# Altium project CmosTest.PrjPCB
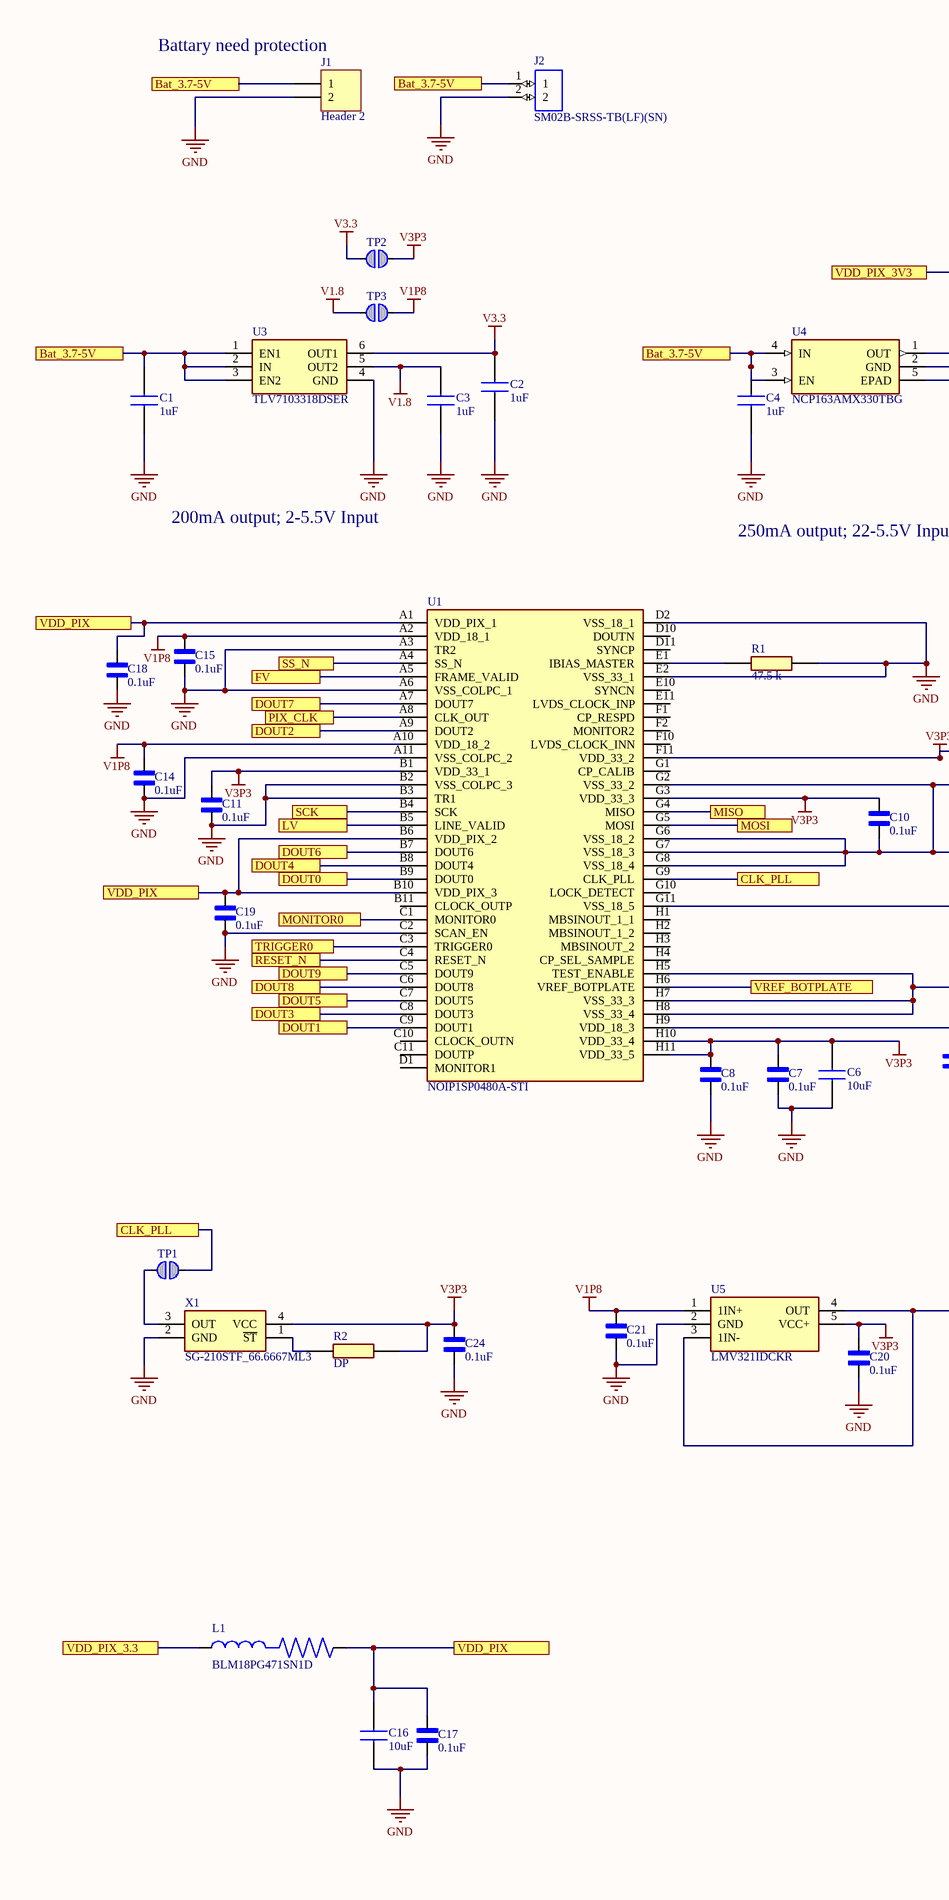
[diagram p0: CmosTest20231115V3.SchDoc, left]
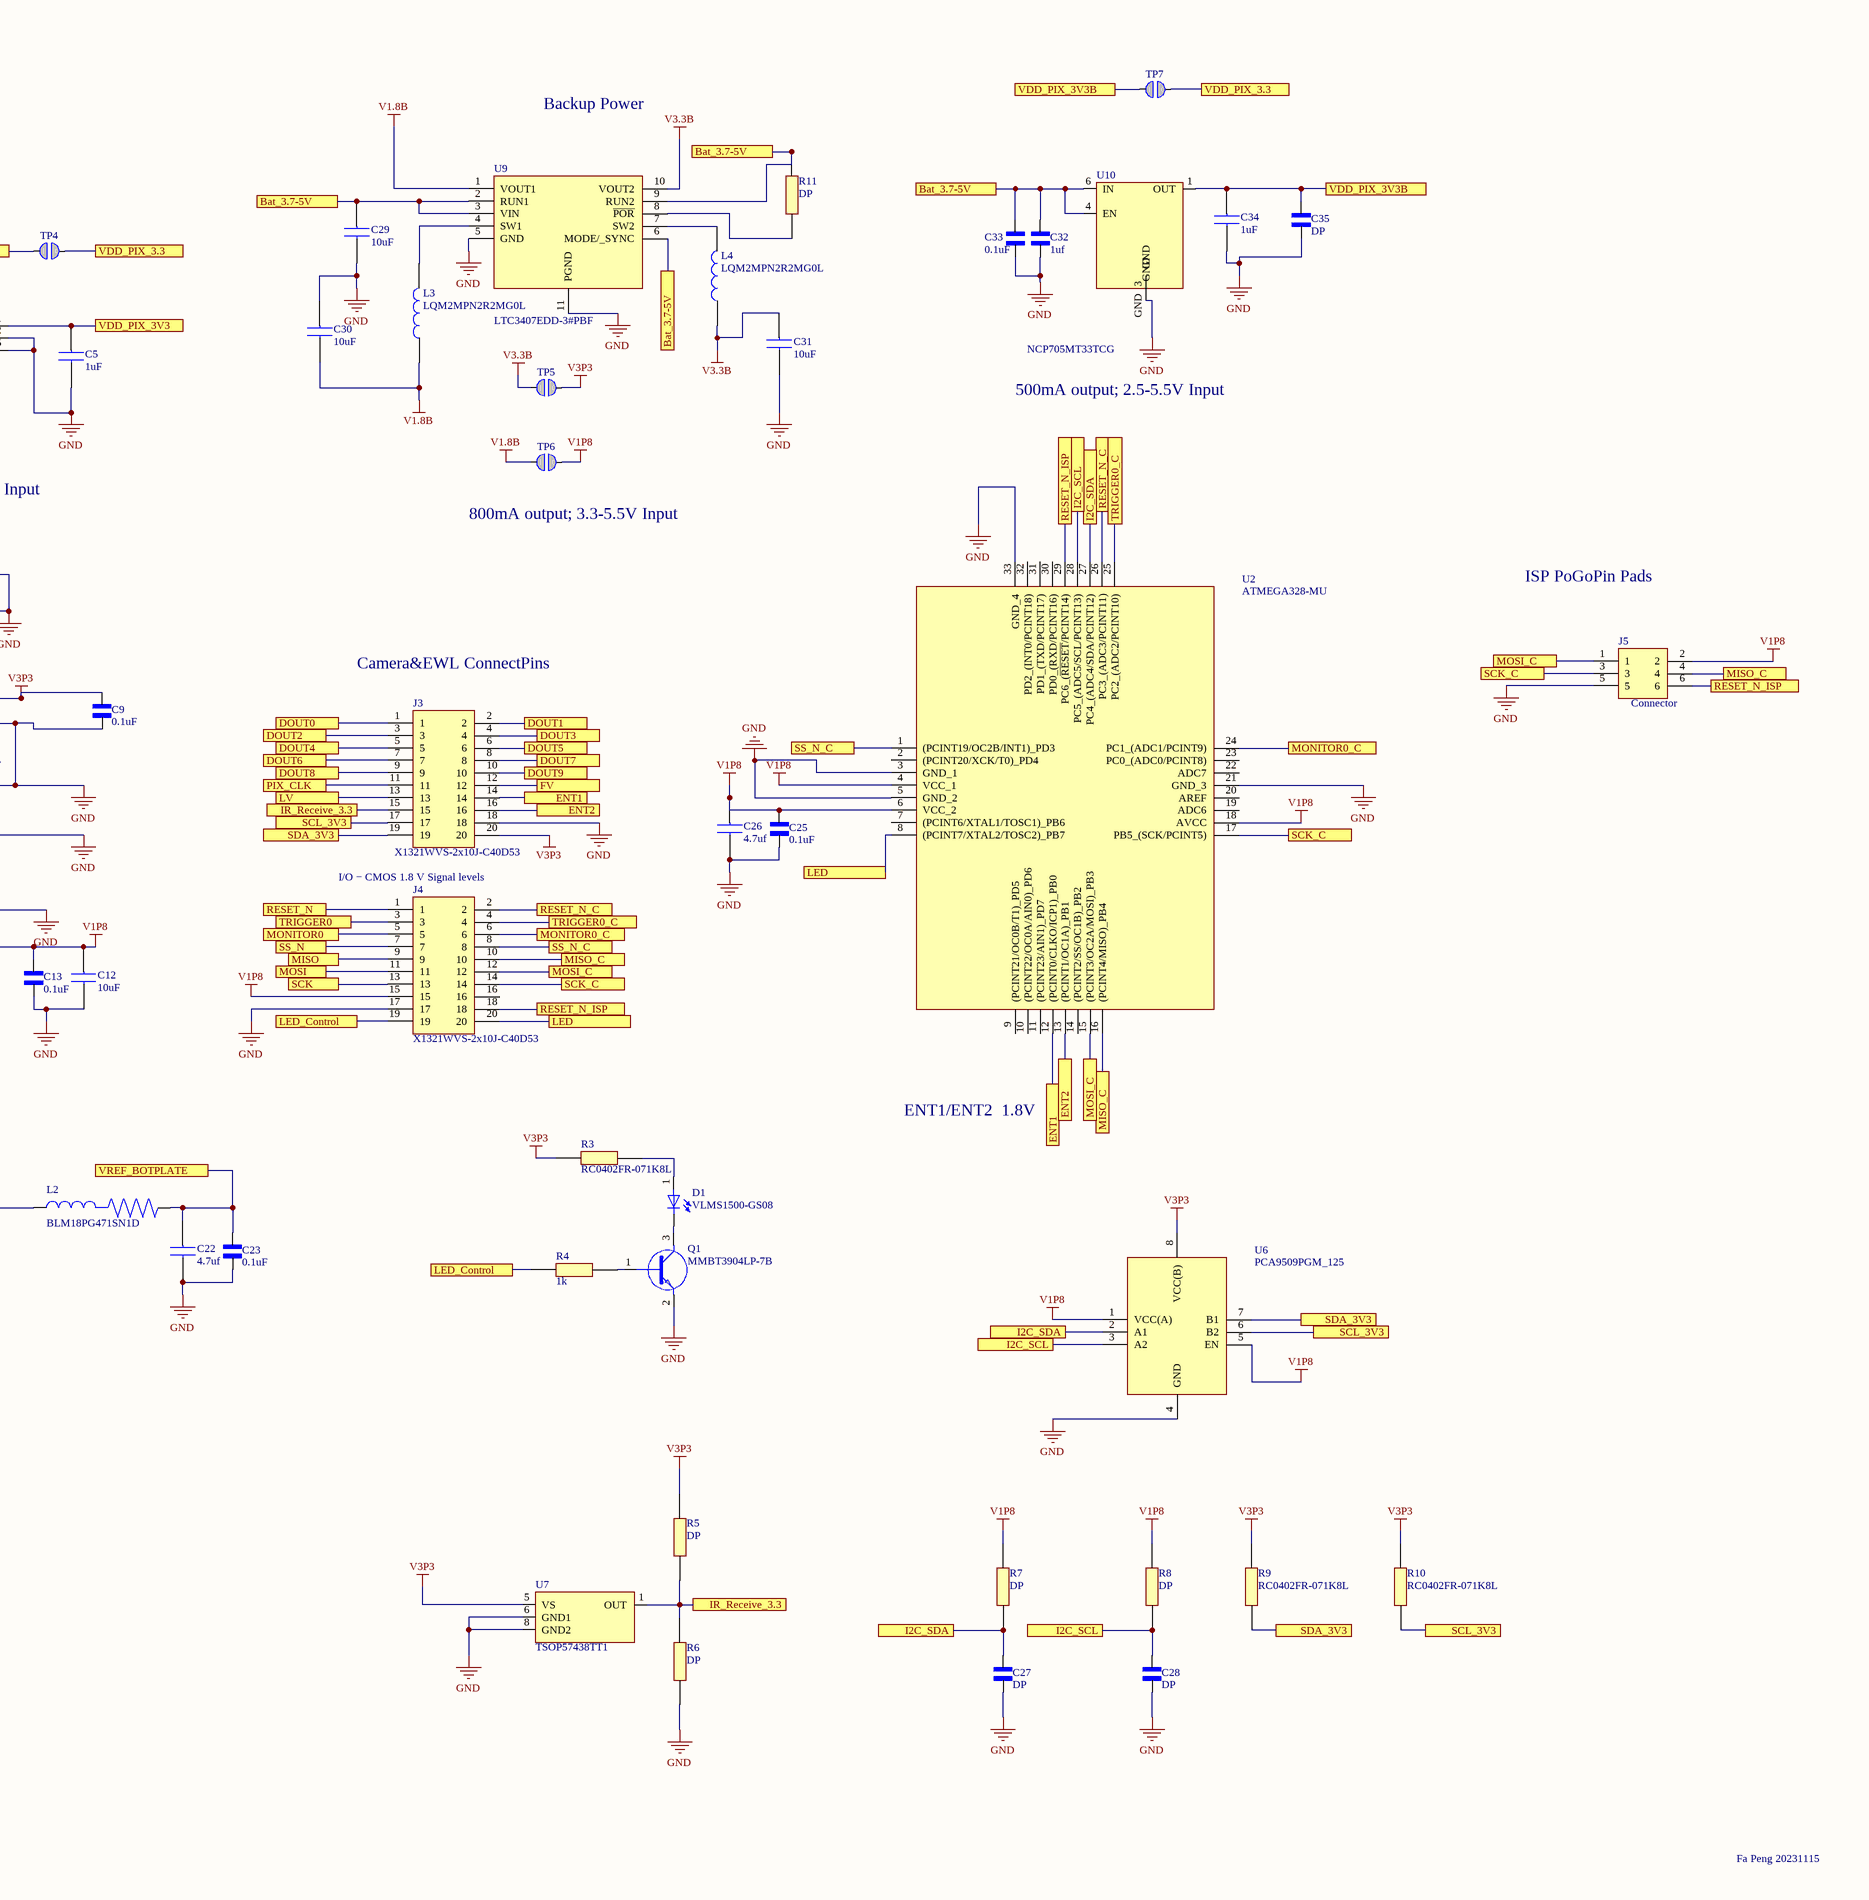
[diagram p1: CmosTest20231115V3.SchDoc, right]
1 sheet, 74 parts. Net scope: flat (ports and power ports of the same name join across sheets).
Board file: CmosTest20231115V2.PcbDoc

## Sheet CmosTest20231115V3.SchDoc
size A2

### Parts
C1  1uF  [CAPC1005X55N]
C2  1uF  [CAPC1005X55N]
C3  1uF  [CAPC1005X55N]
C4  1uF  [CAPC1005X55N]
C5  1uF  [CAPC1005X55N]
C6  10uF  [CAPC1005X56N]
C7  0.1uF  [CAPC1005X55N]
C8  0.1uF  [CAPC1005X55N]
C9  0.1uF  [CAPC1005X55N]
C10  0.1uF  [CAPC1005X55N]
C11  0.1uF  [CAPC1005X55N]
C12  10uF  [CAPC1005X56N]
C13  0.1uF  [CAPC1005X55N]
C14  0.1uF  [CAPC1005X55N]
C15  0.1uF  [CAPC1005X55N]
C16  10uF  [CAPC1005X56N]
C17  0.1uF  [CAPC1005X55N]
C18  0.1uF  [CAPC1005X55N]
C19  0.1uF  [CAPC1005X55N]
C20  0.1uF  [CAPC1005X55N]
C21  0.1uF  [CAPC1005X55N]
C22  4.7uf  [CAPC1005X56N]
C23  0.1uF  [CAPC1005X55N]
C24  0.1uF  [CAPC1005X55N]
C25  0.1uF  [CAPC1005X55N]
C26  4.7uf  [CAPC1005X56N]
C27  DP  [CAPC1005X55N]
C28  DP  [CAPC1005X55N]
C29  10uF  [CAPC1005X56N]
C30  10uF  [CAPC1005X56N]
C31  10uF  [CAPC1005X56N]
C32  1uf  [CAPC1005X55N]
C33  0.1uF  [CAPC1005X55N]
C34  1uF  [CAPC1005X55N]
C35  DP  [CAPC1005X55N]
D1  VLMS1500-GS08  [RESC1005X40N]
J1  Header 2  [Head2_pad]
J2  SM02B-SRSS-TB(LF)(SN)  [SM02B-SRSS-TB(LF)(SN)]
J3  X1321WVS-2x10J-C40D53  [62332021021]
J4  X1321WVS-2x10J-C40D53  [62332021021]
J5  Component_1  (value not drawn)
L1  BLM18PG471SN1D  [BEADC1608X95N]
L2  BLM18PG471SN1D  [BEADC1608X95N]
L3  LQM2MPN2R2MG0L  [LQM2MPN1R0NG0L]
L4  LQM2MPN2R2MG0L  [LQM2MPN1R0NG0L]
Q1  MMBT3904LP-7B  [MMBT3904LP7B]
R1  47.5 k  [RESC1005X40N]
R2  DP  [RESC1005X40N]
R3  RC0402FR-071K8L  [RESC1005X40N]
R4  1k  [RESC1005X40N]
R5  DP  [RESC1005X40N]
R6  DP  [RESC1005X40N]
R7  DP  [RESC1005X40N]
R8  DP  [RESC1005X40N]
R9  RC0402FR-071K8L  [RESC1005X40N]
R10  RC0402FR-071K8L  [RESC1005X40N]
R11  DP  [RESC1005X40N]
TP1  Solderbridge  [Solderbridge]  (value not drawn)  (no BOM)
TP2  Solderbridge  [Solderbridge]  (value not drawn)  (no BOM)
TP3  Solderbridge  [Solderbridge]  (value not drawn)  (no BOM)
TP4  Solderbridge  [Solderbridge]  (value not drawn)  (no BOM)
TP5  Solderbridge  [Solderbridge]  (value not drawn)  (no BOM)
TP6  Solderbridge  [Solderbridge]  (value not drawn)  (no BOM)
TP7  Solderbridge  [Solderbridge]  (value not drawn)  (no BOM)
U1  NOIP1SP0480A-STI  [NOIP1SP0480ASTI]
U2  ATMEGA328-MU  [QFN50P500X500X100-33N-D]
U3  TLV7103318DSER  [SON50P150X150X80-6N]
U4  NCP163AMX330TBG  [REG_NCP114AMX330TBG]
U5  LMV321IDCKR  [SOT65P210X110-5N]
U6  PCA9509PGM_125  [PCA9509PGM125]
U7  TSOP57438TT1  [TSOP572]
U9  LTC3407EDD-3#PBF  [SON50P300X300X80-11N-D]
U10  NCP705MT33TCG  [WDFN6]
X1  SG-210STF_66.6667ML3  [SG210STF625000ML3]

### Ports
Bat_3.7-5V, CLK_PLL, DOUT0, DOUT1, DOUT2, DOUT3, DOUT4, DOUT5, DOUT6, DOUT7, DOUT8, DOUT9, ENT1, ENT2, FV, I2C_SCL, I2C_SDA, IR_Receive_3.3, LED, LED_Control, LV, MISO, MISO_C, MONITOR0, MONITOR0_C, MOSI, MOSI_C, PIX_CLK, RESET_N, RESET_N_C, RESET_N_ISP, SCK, SCK_C, SCL_3V3, SDA_3V3, SS_N, SS_N_C, TRIGGER0, TRIGGER0_C, VDD_PIX, VDD_PIX_3.3, VDD_PIX_3V3, VDD_PIX_3V3B, VREF_BOTPLATE

### Nets
GND: C1.1 C2.1 C3.1 C4.1 C5.1 C6.1 C7.2 C8.2 C9.2 C10.2 C11.2 C12.1 C13.2 C14.2 C15.2 C16.1 C17.2 C18.2 C19.2 C20.2 C21.2 C22.1 C23.2 C24.2 C25.2 C26.1 C27.2 C28.2 C29.1 C30.2 C31.1 C32.1 C33.2 C34.1 C35.2 J1.2 J2.2 J3.18 J4.17 J5.5 Q1.2(E) R1.2 R6.2 U1.A3(TR2) U1.A6(VSS_COLPC_1) U1.A11(VSS_COLPC_2) U1.B2(VSS_COLPC_3) U1.B3(TR1) U1.C2(SCAN_EN) U1.D2(VSS_18_1) U1.E2(VSS_33_1) U1.G2(VSS_33_2) U1.G6(VSS_18_2) U1.G7(VSS_18_3) U1.G8(VSS_18_4) U1.G11(VSS_18_5) U1.H5(TEST_ENABLE) U1.H7(VSS_33_3) U1.H8(VSS_33_4) U2.3(GND_1) U2.5(GND_2) U2.21(GND_3) U2.33(GND_4) U3.4(GND) U4.2(GND) U4.5(EPAD) U5.2(GND) U6.4(GND) U7.6(GND1) U7.8(GND2) U9.5(GND) U9.11(PGND) U10.GND X1.2(GND)
V1.8: C3.2 TP3.2 U3.5(OUT2)
V1.8B: C30.1 L3.1 TP6.2 U9.1(VOUT1)
V1P8: C12.2 C13.1 C14.1 C15.1 C21.1 C25.1 C26.2 J4.15 J5.2 R7.1 R8.1 TP3.1 TP6.1 U1.A2(VDD_18_1) U1.A10(VDD_18_2) U1.H9(VDD_18_3) U2.4(VCC_1) U2.6(VCC_2) U2.18(AVCC) U5.1(1IN+) U6.1(VCC(A)) U6.5(EN)
V3.3: C2.2 TP2.2 U3.6(OUT1)
V3.3B: C31.2 L4.1 TP5.2 U9.10(VOUT2)
V3P3: C6.2 C7.1 C8.1 C9.1 C10.1 C11.1 C20.1 C24.1 J3.20 R2.1 R3.1 R5.1 R9.2 R10.2 TP2.1 TP5.1 U1.B1(VDD_33_1) U1.F11(VDD_33_2) U1.G3(VDD_33_3) U1.H10(VDD_33_4) U1.H11(VDD_33_5) U5.5(VCC+) U6.8(VCC(B)) U7.5(VS) X1.4(VCC)
NetC1_2: C1.2 C4.2 C29.2 C32.2 C33.1 J1.1 J2.1 R11.2 U3.1(EN1) U3.2(IN) U3.3(EN2) U4.3(EN) U4.4(IN) U9.2(RUN1) U9.3(VIN) U9.6(MODE/_SYNC) U9.9(RUN2) U10.4(EN) U10.6(IN) ; port Bat_3.7-5V
NetC5_2: C5.2 TP4.2 U4.1(OUT) ; port VDD_PIX_3V3
NetC16_2: C16.2 C17.1 C18.1 C19.1 L1.2 U1.A1(VDD_PIX_1) U1.B6(VDD_PIX_2) U1.B10(VDD_PIX_3) ; port VDD_PIX
NetC22_2: C22.2 C23.1 L2.2 U1.H6(VREF_BOTPLATE) ; port VREF_BOTPLATE
NetC27_1: C27.1 R7.2 U2.27(PC4_(ADC4/SDA/PCINT12)) U6.2(A1) ; port I2C_SDA
NetC28_1: C28.1 R8.2 U2.28(PC5_(ADC5/SCL/PCINT13)) U6.3(A2) ; port I2C_SCL
NetC34_2: C34.2 C35.1 TP7.2 U10.1(OUT) ; port VDD_PIX_3V3B
NetD1_1: D1.1 R3.2
NetD1_2: D1.2 Q1.3(C)
NetJ3_1: J3.1 U1.B9(DOUT0) ; port DOUT0
NetJ3_2: J3.2 U1.C9(DOUT1) ; port DOUT1
NetJ3_3: J3.3 U1.A9(DOUT2) ; port DOUT2
NetJ3_4: J3.4 U1.C8(DOUT3) ; port DOUT3
NetJ3_5: J3.5 U1.B8(DOUT4) ; port DOUT4
NetJ3_6: J3.6 U1.C7(DOUT5) ; port DOUT5
NetJ3_7: J3.7 U1.B7(DOUT6) ; port DOUT6
NetJ3_8: J3.8 U1.A7(DOUT7) ; port DOUT7
NetJ3_9: J3.9 U1.C6(DOUT8) ; port DOUT8
NetJ3_10: J3.10 U1.C5(DOUT9) ; port DOUT9
NetJ3_11: J3.11 U1.A8(CLK_OUT) ; port PIX_CLK
NetJ3_12: J3.12 U1.A5(FRAME_VALID) ; port FV
NetJ3_13: J3.13 U1.B5(LINE_VALID) ; port LV
NetJ3_14: J3.14 U2.12((PCINT0/CLKO/ICP1)_PB0) ; port ENT1
NetJ3_15: J3.15 R5.2 R6.1 U7.1(OUT) ; port IR_Receive_3.3
NetJ3_16: J3.16 U2.13((PCINT1/OC1A)_PB1) ; port ENT2
NetJ3_17: J3.17 R10.1 U6.6(B2) ; port SCL_3V3
NetJ3_19: J3.19 R9.1 U6.7(B1) ; port SDA_3V3
NetJ4_1: J4.1 U1.C4(RESET_N) ; port RESET_N
NetJ4_2: J4.2 U2.26(PC3_(ADC3/PCINT11)) ; port RESET_N_C
NetJ4_3: J4.3 U1.C3(TRIGGER0) ; port TRIGGER0
NetJ4_4: J4.4 U2.25(PC2_(ADC2/PCINT10)) ; port TRIGGER0_C
NetJ4_5: J4.5 U1.C1(MONITOR0) ; port MONITOR0
NetJ4_6: J4.6 U2.24(PC1_(ADC1/PCINT9)) ; port MONITOR0_C
NetJ4_7: J4.7 U1.A4(SS_N) ; port SS_N
NetJ4_8: J4.8 U2.1((PCINT19/OC2B/INT1)_PD3) ; port SS_N_C
NetJ4_9: J4.9 U1.G4(MISO) ; port MISO
NetJ4_10: J4.10 J5.4 U2.16((PCINT4/MISO)_PB4) ; port MISO_C
NetJ4_11: J4.11 U1.G5(MOSI) ; port MOSI
NetJ4_12: J4.12 J5.1 U2.15((PCINT3/OC2A/MOSI)_PB3) ; port MOSI_C
NetJ4_13: J4.13 U1.B4(SCK) ; port SCK
NetJ4_14: J4.14 J5.3 U2.17(PB5_(SCK/PCINT5)) ; port SCK_C
NetJ4_18: J4.18 J5.6 U2.29(PC6_(~{RESET}/PCINT14)) ; port RESET_N_ISP
NetJ4_19: J4.19 R4.1 ; port LED_Control
NetJ4_20: J4.20 U2.8((PCINT7/XTAL2/TOSC2)_PB7) ; port LED
NetL1_1: L1.1 TP4.1 TP7.1 ; port VDD_PIX_3.3
NetL2_1: L2.1 U5.3(1IN-) U5.4(OUT)
NetL3_2: L3.2 U9.4(SW1)
NetL4_2: L4.2 U9.7(SW2)
NetQ1_1: Q1.1(B) R4.2
NetR1_1: R1.1 U1.E1(IBIAS_MASTER)
NetR2_2: R2.2 X1.1(~{ST})
NetR11_1: R11.1 U9.8(~{POR})
NetTP1_1: TP1.1 X1.3(OUT)
NetTP1_2: TP1.2 U1.G9(CLK_PLL) ; port CLK_PLL

Not connected (* = marked no-connect by the designer): J4 16; U1 B11(CLOCK_OUTP) C10(CLOCK_OUTN) C11(DOUTP) D1(MONITOR1) D10(DOUTN) D11(SYNCP) E10(SYNCN) E11(LVDS_CLOCK_INP) F1(CP_RESPD) F2(MONITOR2) F10(LVDS_CLOCK_INN) G1(CP_CALIB) G10(LOCK_DETECT) H1(MBSINOUT_1_1) H2(MBSINOUT_1_2) H3(MBSINOUT_2) H4(CP_SEL_SAMPLE); U2 2((PCINT20/XCK/T0)_PD4) 7((PCINT6/XTAL1/TOSC1)_PB6) 9((PCINT21/OC0B/T1)_PD5) 10((PCINT22/OC0A/AIN0)_PD6) 11((PCINT23/AIN1)_PD7) 14((PCINT2/SS/OC1B)_PB2) 19(ADC6) 20(AREF) 22(ADC7) 23(PC0_(ADC0/PCINT8)) 30(PD0_(RXD/PCINT16)) 31(PD1_(TXD/PCINT17)) 32(PD2_(INT0/PCINT18)); U10 3(GND)

### Notes on the sheet
- (near J1) Battary need protection
- Backup Power
- 500mA output; 2.5-5.5V Input
- 200mA output; 2-5.5V Input
- 250mA output; 22-5.5V Input
- (near TP6) 800mA output; 3.3-5.5V Input
- ISP PoGoPin Pads
- Camera&EWL ConnectPins
- I/O − CMOS 1.8 V Signal levels
- ENT1/ENT2  1.8V
- Fa Peng 20231115
- (in symbol Component_1) Connector

### Library data of the parts
C1 C4 C5 C34 = CC0402KRX5R6BB105: General purpose & High capacitance Class 2, X5R; Manufacturer_Name: KEMET; Geometry.Height: 0.55mm; Manufacturer_Part_Number: CC0402KRX5R6BB105; Mouser Part Number: 603-CC402KRX5R6BB105; Mouser Price/Stock: https://www.mouser.co.uk/ProductDetail/YAGEO/CC0402KRX5R6BB105?qs=BKNoF%2F0xMNu0TvpE6ze2Iw%3D%3D; Arrow Part Number: *; Arrow Price/Stock: *; Datasheet Link: https://www.mouser.co.uk/datasheet/2/447/UPY-GPHC_X5R_4V-to-50V_25-1131599.pdf
C2 = CC0402KRX5R6BB105: CC0402KRX5R6BB105;General purpose & High capacitance Class 2, X5R; Manufacturer_Name: KEMET; Geometry.Height: 0.55mm; Manufacturer_Part_Number: CC0402KRX5R6BB105; Mouser Part Number: 603-CC402KRX5R6BB105; Mouser Price/Stock: https://www.mouser.co.uk/ProductDetail/YAGEO/CC0402KRX5R6BB105?qs=BKNoF%2F0xMNu0TvpE6ze2Iw%3D%3D; Arrow Part Number: *; Arrow Price/Stock: *; Datasheet Link: https://www.mouser.co.uk/datasheet/2/447/UPY-GPHC_X5R_4V-to-50V_25-1131599.pdf
C3 = CC0402KRX5R6BB105: CC0402KRX5R6BB105; General purpose & High capacitance Class 2, X5R; Manufacturer_Name: KEMET; Geometry.Height: 0.55mm; Manufacturer_Part_Number: CC0402KRX5R6BB105; Mouser Part Number: 603-CC402KRX5R6BB105; Mouser Price/Stock: https://www.mouser.co.uk/ProductDetail/YAGEO/CC0402KRX5R6BB105?qs=BKNoF%2F0xMNu0TvpE6ze2Iw%3D%3D; Arrow Part Number: *; Arrow Price/Stock: *; Datasheet Link: https://www.mouser.co.uk/datasheet/2/447/UPY-GPHC_X5R_4V-to-50V_25-1131599.pdf
C6 C12 C16 C29-C31 = 0402ZD106MAT2A: 0402ZD106MAT2A; Multilayer Ceramic Capacitors MLCC - SMD/SMT 10V 10uF X5R 0402 20% Tol; Manufacturer_Name: AVX; Geometry.Height: 0.56mm; Manufacturer_Part_Number: 0402ZD106MAT2A; Mouser Part Number: 581-0402ZD106MAT2A; Mouser Price/Stock: https://www.mouser.co.uk/ProductDetail/AVX/0402ZD106MAT2A?qs=sJ5gq5MLFXpDfmjiItAxIg%3D%3D; Arrow Part Number: 0402ZD106MAT2A; Arrow Price/Stock: https://www.arrow.com/en/products/0402zd106mat2a/avx; Datasheet Link: http://www.mouser.com/catalog/supplier/library/pdf/AVXSurfaceMountCeramic.pdf
C7-C11 C13-C15 C17-C21 C23-C25 C27 C28 = GRM155R71C104KA88D: SMD Capacitor X7R_EIA_ with Capacitance: 0.10uF Tol. 10%. Rated Voltage: 16Vdc;GRM155R71C104KA88D; MF: Murata; Package: 1005 Taiyo Yuden; Value: *; MP: GRM155R71C104KA88D; SnapEDA_Link: https://www.snapeda.com/parts/GRM155R71C104KA88D/Murata%20Electronics%20North%20America/view-part/4750/?ref=snap
C22 C26 = 0402ZD475KAT2A: 0402ZD475KAT2A; Multilayer Ceramic Capacitors MLCC - SMD/SMT 10V 4.7uF 0402 10% CX5R; Manufacturer_Name: AVX; Geometry.Height: 0.56mm; Manufacturer_Part_Number: 0402ZD475KAT2A; Mouser Part Number: 581-0402ZD475KAT2A; Mouser Price/Stock: https://www.mouser.co.uk/ProductDetail/AVX/0402ZD475KAT2A?qs=%252BdQmOuGyFcGZ9hW2HGkxhw%3D%3D; Arrow Part Number: 0402ZD475KAT2A; Arrow Price/Stock: https://www.arrow.com/en/products/0402zd475kat2a/avx; Datasheet Link: http://www.mouser.com/catalog/supplier/library/pdf/AVXSurfaceMountCeramic.pdf
C32 C33 C35 = GRM155R71C104KA88D: SMD Capacitor X7R_EIA_ with Capacitance: 0.10uF Tol. 10%. Rated Voltage: 16Vdc; MF: Murata; Package: 1005 Taiyo Yuden; Value: *; MP: GRM155R71C104KA88D; SnapEDA_Link: https://www.snapeda.com/parts/GRM155R71C104KA88D/Murata%20Electronics%20North%20America/view-part/4750/?ref=snap
D1 = VLMG1500-GS08: Super red 631nm LED Indication - Discrete 2V 0402 _1005 Metric_; MF: Vishay; Price: None; Availability: Unavailable; Package: 0402 Vishay; SnapEDA_Link: https://www.snapeda.com/parts/VLMG1500-GS08/Vishay%20Semiconductor%20Opto%20Division/view-part/450066/?ref=snap; MP: VLMG1500-GS08; Value: *
J1 = Header 2: Header, 2-Pin; LatestRevisionDate: 17-Jul-2002; LatestRevisionNote: Re-released for DXP Platform.; Publisher: Altium Limited
J2 = SM02B-SRSS-TB(LF)(SN): Connector Header Surface Mount, Right Angle 2 position 0.039 _1.00mm_; MP: SM02B-SRSS-TB_LF__SN_; MF: JST Sales; SnapEDA_Link: https://www.snapeda.com/parts/SM02B-SRSS-TB%28LF%29%28SN%29/JST%20Sales%20America%20Inc./view-part/447499/?ref=snap; Price: None; Value: *; Availability: Unavailable; Package: None
J3 J4 = 62332021021: X1321WVS-2x10J-C40D53; / Receptacle, Board-to-Board, 1.27 mm, 2 Rows, 20 Contacts, Surface Mount, WR-PHD Series; Manufacturer_Name: Wurth Elektronik; Geometry.Height: 4.7mm; Manufacturer_Part_Number: 62332021021; Mouser Part Number: 710-62332021021; Mouser Price/Stock: https://www.mouser.co.uk/ProductDetail/Wurth-Elektronik/62332021021?qs=7D1LtPJG0i3NvUz0HzEmOg%3D%3D; Arrow Part Number: *; Arrow Price/Stock: *; Datasheet Link: https://componentsearchengine.com/Datasheets/2/62332021021.pdf
L1 L2 = BLM18PG471SN1D: 470 Ohms @ 100MHz 1 Power Line Ferrite Bead 0603 _1608 Metric_ 1A 200mOhm; MF: Murata; Digi-Key_Purchase_URL: https://www.digikey.com.au/product-detail/en/murata-electronics/BLM18PG471SN1D/490-5223-1-ND/1948399?utm_source=snapeda&utm_medium=aggregator&utm_campaign=symbol; Value: *; Package: 1608 Murata; Digi-Key_Part_Number: 490-5223-1-ND; SnapEDA_Link: https://www.snapeda.com/parts/BLM18PG471SN1D/Murata/view-part/234090/?ref=snap; MP: BLM18PG471SN1D
L3 L4 = LQM2MPN2R2MG0L: LQM2MPN_G0 Series Inductor 2.2uH +/-20% 0806 (2016); Manufacturer_Name: Murata Electronics; Geometry.Height: 1mm; Manufacturer_Part_Number: LQM2MPN2R2MG0L; Mouser Part Number: 81-LQM2MPN2R2MG0L; Mouser Price/Stock: https://www.mouser.co.uk/ProductDetail/Murata-Electronics/LQM2MPN2R2MG0L?qs=YinlzBdtFMj9%2Fj5t8GanUg%3D%3D; Arrow Part Number: LQM2MPN2R2MG0L; Arrow Price/Stock: https://www.arrow.com/en/products/lqm2mpn2r2mg0l/murata-manufacturing?region=nac; Datasheet Link: https://psearch.en.murata.com/inductor/product/LQM2MPN2R2MG0%23.html
Q1 = MMBT3904LP-7B: Bipolar Transistors - BJT General Purpose Tran X1-DFN1006-3,10K 40V NPN SMALL SIGNAL TRANSISTOR IN X1-DFN1006-3; Manufacturer_Name: Diodes Inc.; Geometry.Height: 0.53mm; Manufacturer_Part_Number: MMBT3904LP-7B; Mouser Part Number: 621-MMBT3904LP-7B; Mouser Price/Stock: https://www.mouser.co.uk/ProductDetail/Diodes-Incorporated/MMBT3904LP-7B?qs=T%2FOtf55vL7cbkUjr%2FmBpPQ%3D%3D; Arrow Part Number: MMBT3904LP-7B; Arrow Price/Stock: https://www.arrow.com/en/products/mmbt3904lp-7b/diodes-incorporated?region=nac; Datasheet Link: https://www.diodes.com/assets/Datasheets/ds31835.pdf
R1 = ERJ-2RKF4752X: ERJ-2RKF4752X; Panasonic Surface Mount Fixed Resistor 47.5 k 0.1 W +/-100 ppm/C; Geometry.Height: 0.4mm; Manufacturer_Name: Panasonic; Manufacturer_Part_Number: ERJ-2RKF4752X; Mouser Part Number: 667-ERJ-2RKF4752X; Mouser Price/Stock: https://www.mouser.co.uk/ProductDetail/Panasonic/ERJ-2RKF4752X?qs=YMBIwoNQYdVljEm11tR4kg%3D%3D; Arrow Part Number: ERJ-2RKF4752X; Arrow Price/Stock: https://www.arrow.com/en/products/erj-2rkf4752x/panasonic; Datasheet Link: https://industrial.panasonic.com/cdbs/www-data/pdf/RDA0000/AOA0000C86.pdf
R2 R5-R8 R11 = RC0402FR-071K8L: Don't place; RESISTOR, 0402; Manufacturer_Name: KEMET; Geometry.Height: 0.4mm; Manufacturer_Part_Number: RC0402FR-071K8L; Mouser Part Number: 603-RC0402FR-071K8L; Mouser Price/Stock: https://www.mouser.co.uk/ProductDetail/Yageo/RC0402FR-071K8L/?qs=YUgVZYePFqBqgTt42z3XkQ%3D%3D; Arrow Part Number: RC0402FR-071K8L; Arrow Price/Stock: https://www.arrow.com/en/products/rc0402fr-071k8l/yageo; Datasheet Link: http://www.yageo.com/documents/recent/PYu-RC0402_51_RoHS_L_6_r.pdf
R3 R9 R10 = RC0402FR-071K8L: RESISTOR, 0402 1.8K Ohms +/-1% 1/16 W; Manufacturer_Name: KEMET; Geometry.Height: 0.4mm; Manufacturer_Part_Number: RC0402FR-071K8L; Mouser Part Number: 603-RC0402FR-071K8L; Mouser Price/Stock: https://www.mouser.co.uk/ProductDetail/Yageo/RC0402FR-071K8L/?qs=YUgVZYePFqBqgTt42z3XkQ%3D%3D; Arrow Part Number: RC0402FR-071K8L; Arrow Price/Stock: https://www.arrow.com/en/products/rc0402fr-071k8l/yageo; Datasheet Link: http://www.yageo.com/documents/recent/PYu-RC0402_51_RoHS_L_6_r.pdf
R4 = ERJ-2RKF4752X: AC0402FR-071KL;  0402 1KΩ ±1% 1/16W ±100ppm/℃; Manufacturer_Name: Panasonic; Geometry.Height: 0.4mm; Manufacturer_Part_Number: ERJ-2RKF4752X; Mouser Part Number: 667-ERJ-2RKF4752X; Mouser Price/Stock: https://www.mouser.co.uk/ProductDetail/Panasonic/ERJ-2RKF4752X?qs=YMBIwoNQYdVljEm11tR4kg%3D%3D; Arrow Part Number: ERJ-2RKF4752X; Arrow Price/Stock: https://www.arrow.com/en/products/erj-2rkf4752x/panasonic; Datasheet Link: https://industrial.panasonic.com/cdbs/www-data/pdf/RDA0000/AOA0000C86.pdf
TP1-TP7 = SOLDERBRIDGE: Manufacturer: N.A.; Pad Count: 2; Part Number: Solderbridge; Manufacturer Part Number: N.A.; LatestRevisionDate: 2009-12-14; Published: 2009-12-14; Value: Solderbridge; Note: N.A.; Artikkelnr Noca: N.A.; Footprint Doc: Solderbridge; Part number IPS: N.A.; ComponentLink1URL: N.A.; ComponentLink1Description: Datasheet; ComponentLink2URL: N.A.; ComponentLink2Description: Supplier link; HelpURL: N.A.; Supplier 1: N.A.; Supplier Part Number 1: N.A.; Supplier 2: N.A.; Supplier Part Number 2: N.A.; PartId: 100500458; Component Class: Connectors; Author: rsk; Part number Norautron: N.A.
U1 = NOIP1SP0480A-STI: Image Sensors PYTHON480 1/3.6 BW_ CRA; Manufacturer_Name: onsemi; Geometry.Height: 0.75mm; Manufacturer_Part_Number: NOIP1SP0480A-STI; Mouser Part Number: 863-NOIP1SP0480A-STI; Mouser Price/Stock: https://www.mouser.co.uk/ProductDetail/ON-Semiconductor/NOIP1SP0480A-STI?qs=MLItCLRbWsyoZFKf%252BDS9uw%3D%3D; Arrow Part Number: *; Arrow Price/Stock: *; Datasheet Link: https://www.onsemi.com/pdf/datasheet/noip1sn0480a-d.pdf
U2 = ATMEGA328-MU: MCU 8-bit ATmega AVR RISC 32KB Flash Atmel ATMEGA328-MU, 8bit AVR Microcontroller, 20MHz, 32 kB Flash, 32-Pin MLF; Manufacturer_Name: Microchip; Geometry.Height: 1mm; Manufacturer_Part_Number: ATMEGA328-MU; Mouser Part Number: 556-ATMEGA328-MU; Mouser Price/Stock: https://www.mouser.co.uk/ProductDetail/Microchip-Technology-Atmel/ATMEGA328-MU?qs=lwdSMh1%2FoYLgRc0I%252Bdg4Ag%3D%3D; Arrow Part Number: ATMEGA328-MU; Arrow Price/Stock: https://www.arrow.com/en/products/atmega328-mu/microchip-technology?region=europe; Datasheet Link: https://componentsearchengine.com/Datasheets/2/ATMEGA328-MU.pdf
U3 = TLV7103318DSER: Manufacturer_Name: Texas Instruments; Geometry.Height: 0.8mm; Manufacturer_Part_Number: TLV7103318DSER; Mouser Part Number: 595-TLV7103318DSER; Mouser Price/Stock: https://www.mouser.co.uk/ProductDetail/Texas-Instruments/TLV7103318DSER?qs=UlfnwZ2x8nSAnP31dntgZA%3D%3D; Arrow Part Number: TLV7103318DSER; Arrow Price/Stock: https://www.arrow.com/en/products/tlv7103318dser/texas-instruments?region=nac; Datasheet Link: https://pdf1.alldatasheet.com/datasheet-pdf/view/457316/TI1/TLV7103318DSER.html
U4 = NCP114AMX330TBG: NCP163(Vi 2.2-5..5V); Linear Voltage Regulator IC Positive Fixed 1 Output 250mA 4-UDFN _1.0x1.0_; MF: ON Semiconductor; MP: NCP114AMX330TBG; Availability: Unavailable; Package: UDFN-4 ON Semiconductor; Value: *; Price: None; SnapEDA_Link: https://www.snapeda.com/parts/NCP114AMX330TBG/ON%20Semiconductor/view-part/711351/?ref=snap
U5 = LMV321IDCKR: Single Low-Voltage Rail-to-Rail Output Operational Amplifier  see LMV321A for upgraded version; Manufacturer_Name: Texas Instruments; Geometry.Height: 1.1mm; Manufacturer_Part_Number: LMV321IDCKR; Mouser Part Number: 595-LMV321IDCKR; Mouser Price/Stock: https://www.mouser.co.uk/ProductDetail/Texas-Instruments/LMV321IDCKR?qs=p6YqzpSxLIzuatXd1sAikQ%3D%3D; Arrow Part Number: LMV321IDCKR; Arrow Price/Stock: https://www.arrow.com/en/products/lmv321idckr/texas-instruments?region=nac; Datasheet Link: http://www.ti.com/lit/ds/symlink/lmv324.pdf
U6 = PCA9509PGM_125: Interface - Signal Buffers, Repeaters I2C/SMBus IC REDRIVER I2C 2CH 400KHZ 8XQFN Repeater Buffer, ReDriver 2 Channel 400kHz 8-XQFN (1.6x1.6); Manufacturer_Name: NXP; Manufacturer_Part_Number: PCA9509PGM,125; Geometry.Height: 0.5mm; Mouser Part Number: 771-PCA9509PGM,125; Mouser Price/Stock: https://www.mouser.co.uk/ProductDetail/NXP-Semiconductors/PCA9509PGM125?qs=vnbNJPHmPnOjnFlZ8zO94w%3D%3D; Arrow Part Number: PCA9509PGM,125; Arrow Price/Stock: https://www.arrow.com/en/products/pca9509pgm125/nxp-semiconductors?region=nac; Datasheet Link: http://www.nxp.com/docs/en/data-sheet/PCA9509P.pdf
U7 = TSOP57238TT1: Remote Receiver Sensor, 38.0kHz 40m Surface Mount; MF: Vishay Semiconductor; SnapEDA_Link: https://www.snapeda.com/parts/TSOP57238TT1/Vishay%20Semiconductor%20Opto%20Division/view-part/395850/?ref=snap; Availability: Warning; MP: TSOP57238TT1; Purchase-URL: https://pricing.snapeda.com/search/part/TSOP57238TT1/?ref=eda; Check_prices: https://www.snapeda.com/parts/TSOP57238TT1/Vishay%20Semiconductor%20Opto%20Division/view-part/395850/?ref=eda; Price: None; Value: *; Package: None
U9 = LTC3407EDD-3#PBF: BUCK, SYNCH, DUAL, 0.8A, 2.25MHZ, 10MSOP; Manufacturer_Name: Analog Devices; Geometry.Height: 0.8mm; Manufacturer_Part_Number: LTC3407EDD-3#PBF; Mouser Part Number: 584-LTC3407EDD-3#PBF; Mouser Price/Stock: https://www.mouser.com/Search/Refine.aspx?Keyword=584-LTC3407EDD-3%23PBF; Arrow Part Number: LTC3407EDD-3#PBF; Arrow Price/Stock: https://www.arrow.com/en/products/ltc3407edd-3pbf/analog-devices; Datasheet Link: https://datasheet.datasheetarchive.com/originals/distributors/SFDatasheet-4/sf-00091830.pdf
U10 = NCP705: Ultra-Low Quiescent Current, Ultra-Low Noise, LDO Voltage Regulator<br> <br> Data sheet: <br> http://www.onsemi.com/pub_link/Collateral/NCP705-D.PDF<br>; Package: None; Price: None; Value: *; MP: NCP705; Availability: Unavailable
X1 = SG-210STF_62.5000ML3: Standard Clock Oscillators 66.6666MHz 50ppm -40C +85C; Manufacturer_Name: Epson Timing; Manufacturer_Part_Number: SG-210STF 62.5000ML3; Geometry.Height: 0.9mm; Mouser Part Number: 732-SG210STF62.500L3; Mouser Price/Stock: https://www.mouser.co.uk/ProductDetail/Epson-Timing/SG-210STF-62.5000ML3?qs=6J2kD0vu%2F2XqkCRh4YYW9A%3D%3D; Arrow Part Number: *; Arrow Price/Stock: *; Datasheet Link: https://componentsearchengine.com/Datasheets/1/SG-210STF 62.5000ML3.pdf